# Altium schematic sheet 03_peripheral.SchDoc
size A3; SheetNumber: 4; SheetTotal: 4
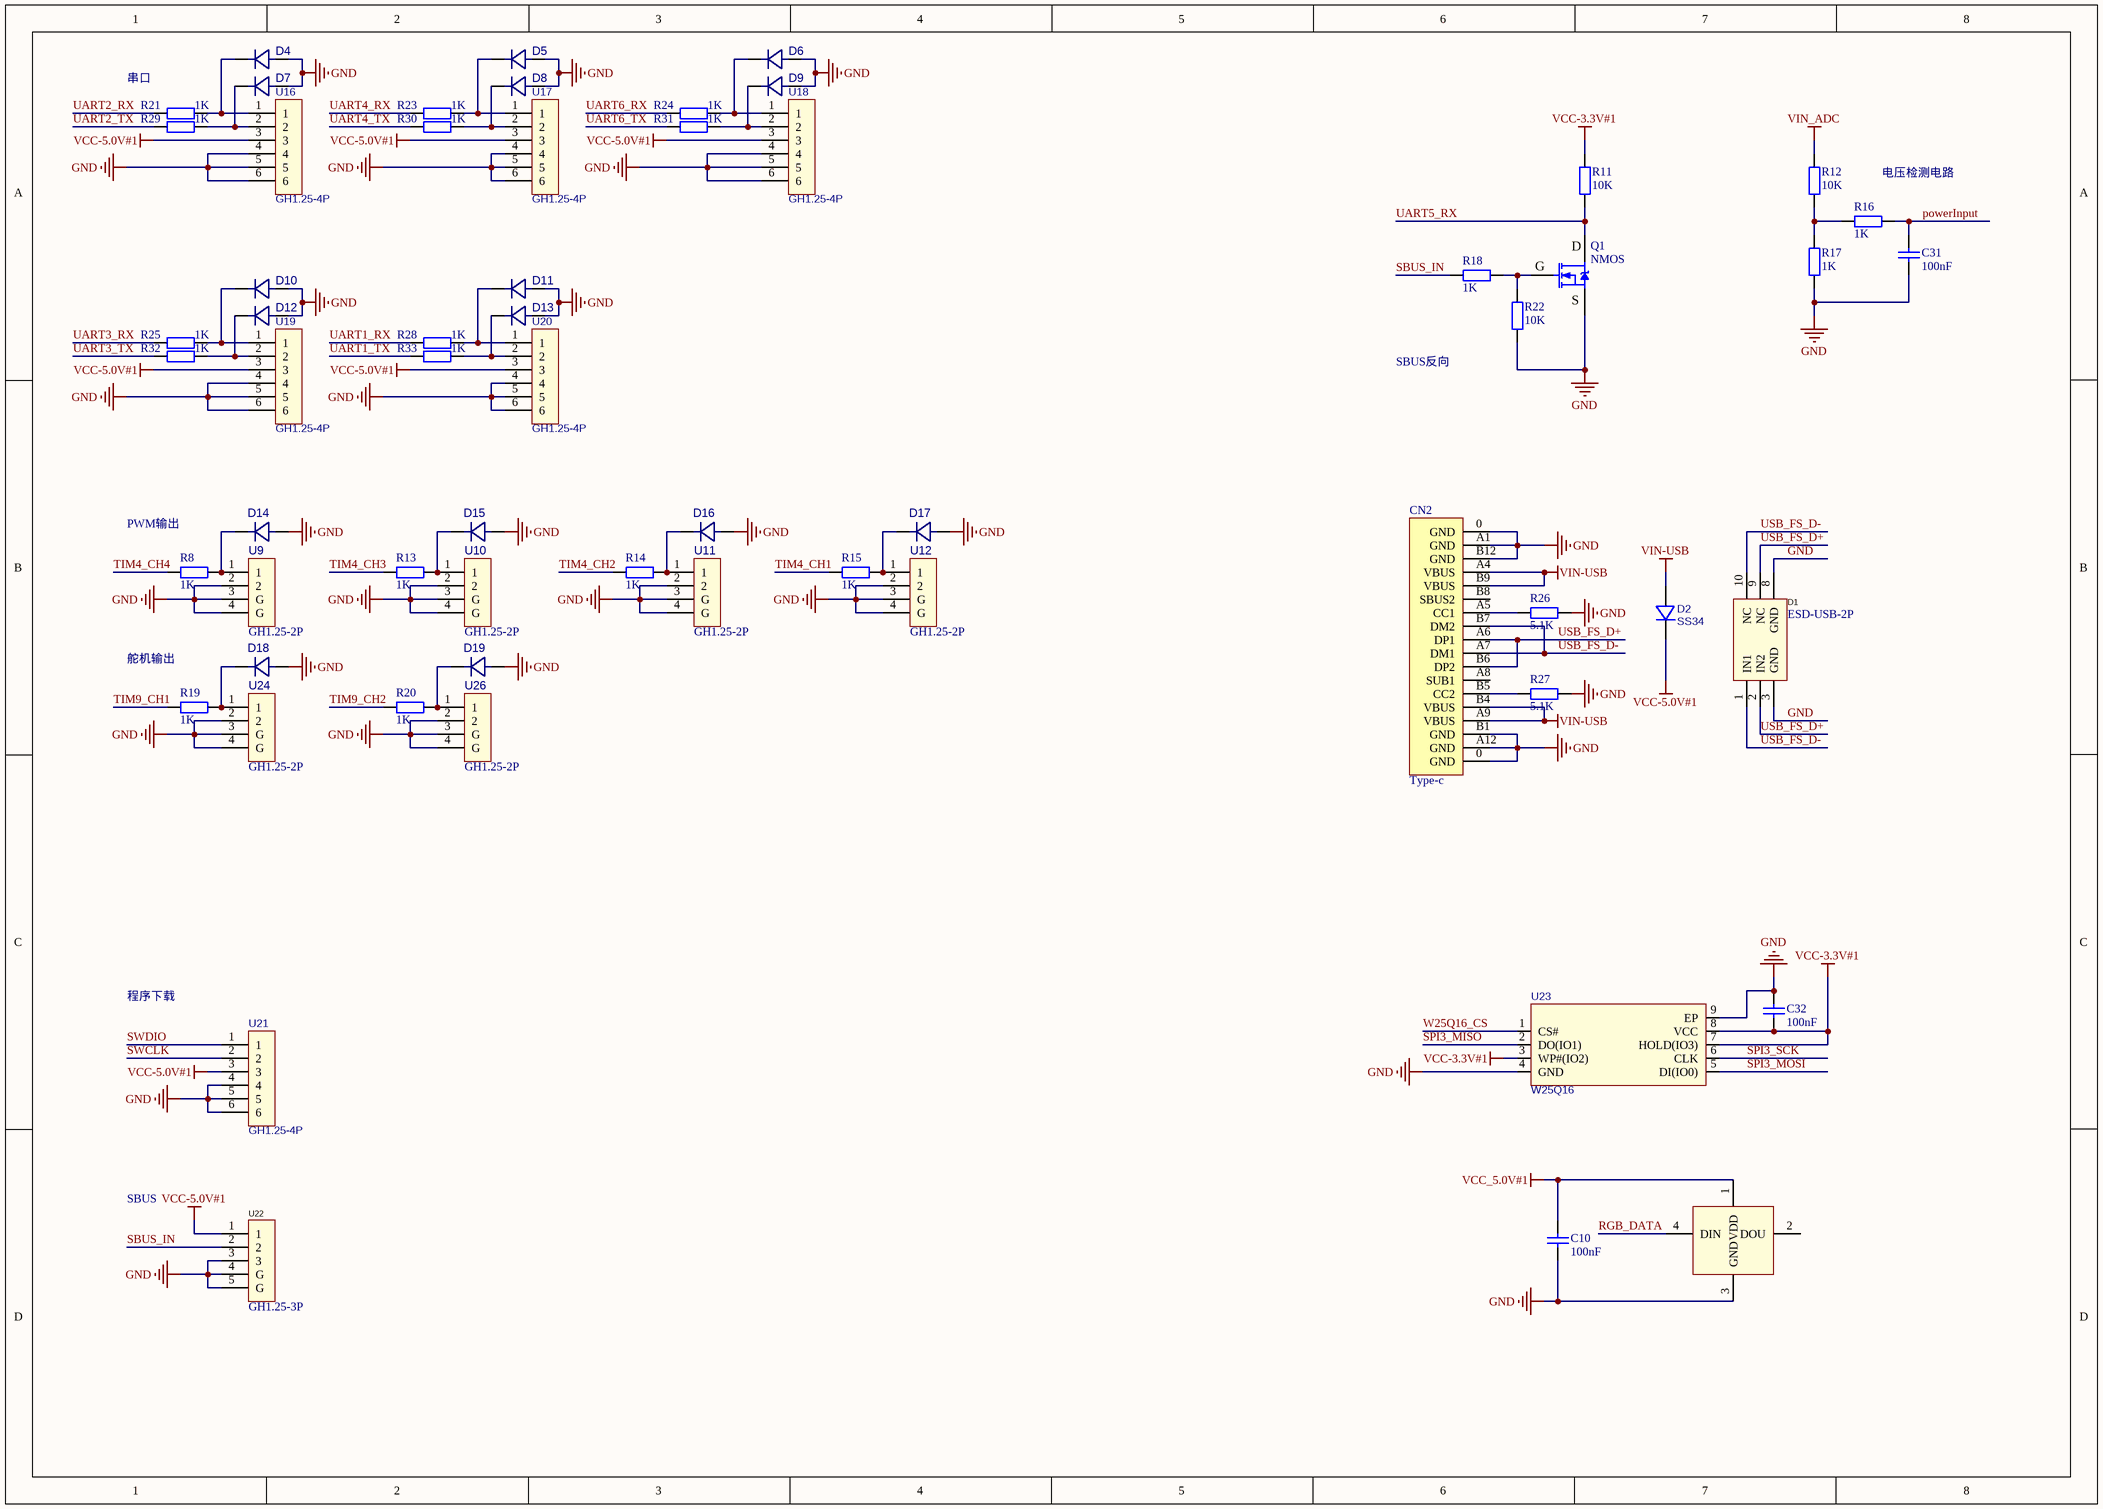
[diagram p0: 03_peripheral.SchDoc]

## Parts
C10  100nF  [0603-C]
C31  100nF  [0603-C]
C32  100nF  [0603-C]
CN2  Type-c  [Type-c 16pin]
D1  ESD-USB-2P  [SLP2510P8-2P]
D2  SS34  [SS34-SMA]
D4  ESD9X5.0ST5G  [ESD9X5.0ST5G]  (value not drawn)
D5  ESD9X5.0ST5G  [ESD9X5.0ST5G]  (value not drawn)
D6  ESD9X5.0ST5G  [ESD9X5.0ST5G]  (value not drawn)
D7  ESD9X5.0ST5G  [ESD9X5.0ST5G]  (value not drawn)
D8  ESD9X5.0ST5G  [ESD9X5.0ST5G]  (value not drawn)
D9  ESD9X5.0ST5G  [ESD9X5.0ST5G]  (value not drawn)
D10  ESD9X5.0ST5G  [ESD9X5.0ST5G]  (value not drawn)
D11  ESD9X5.0ST5G  [ESD9X5.0ST5G]  (value not drawn)
D12  ESD9X5.0ST5G  [ESD9X5.0ST5G]  (value not drawn)
D13  ESD9X5.0ST5G  [ESD9X5.0ST5G]  (value not drawn)
D14  ESD9X5.0ST5G  [ESD9X5.0ST5G]  (value not drawn)
D15  ESD9X5.0ST5G  [ESD9X5.0ST5G]  (value not drawn)
D16  ESD9X5.0ST5G  [ESD9X5.0ST5G]  (value not drawn)
D17  ESD9X5.0ST5G  [ESD9X5.0ST5G]  (value not drawn)
D18  ESD9X5.0ST5G  [ESD9X5.0ST5G]  (value not drawn)
D19  ESD9X5.0ST5G  [ESD9X5.0ST5G]  (value not drawn)
LED3  WS2812B-5050  [WS2812B-5050]  (value not drawn)
Q1  NMOS  [SOT23-3M]
R8  1K  [0603-R]
R11  10K  [0603-R]
R12  10K  [0603-R]
R13  1K  [0603-R]
R14  1K  [0603-R]
R15  1K  [0603-R]
R16  1K  [0603-R]
R17  1K  [0603-R]
R18  1K  [0603-R]
R19  1K  [0603-R]
R20  1K  [0603-R]
R21  1K  [0603-R]
R22  10K  [0603-R]
R23  1K  [0603-R]
R24  1K  [0603-R]
R25  1K  [0603-R]
R26  5.1K  [0603-R]
R27  5.1K  [0603-R]
R28  1K  [0603-R]
R29  1K  [0603-R]
R30  1K  [0603-R]
R31  1K  [0603-R]
R32  1K  [0603-R]
R33  1K  [0603-R]
U9  GH1.25-2P  [GH1.25-2P]
U10  GH1.25-2P  [GH1.25-2P]
U11  GH1.25-2P  [GH1.25-2P]
U12  GH1.25-2P  [GH1.25-2P]
U16  GH1.25-4P  [CONN-SMD_GH1.25-4PWBPZ]
U17  GH1.25-4P  [CONN-SMD_GH1.25-4PWBPZ]
U18  GH1.25-4P  [CONN-SMD_GH1.25-4PWBPZ]
U19  GH1.25-4P  [CONN-SMD_GH1.25-4PWBPZ]
U20  GH1.25-4P  [CONN-SMD_GH1.25-4PWBPZ]
U21  GH1.25-4P  [CONN-SMD_GH1.25-4PWBPZ]
U22  GH1.25-3P  [GH1.25-3P]
U23  W25Q16  [W25QXX_WSON_8_5*6mm]
U24  GH1.25-2P  [GH1.25-2P]
U26  GH1.25-2P  [GH1.25-2P]

## Nets
GND: C10.1 C31.1 C32.2 CN2.0(GND) CN2.A1(GND) CN2.A12(GND) CN2.B1(GND) CN2.B12(GND) D1.3(GND) D1.8(GND) D4.2(A) D5.2(A) D6.2(A) D7.2(A) D8.2(A) D9.2(A) D10.2(A) D11.2(A) D12.2(A) D13.2(A) D14.2(A) D15.2(A) D16.2(A) D17.2(A) D18.2(A) D19.2(A) LED3.3(GND) Q1.2(S) R17.1 R22.1 R26.2 R27.2 U9.2 U9.3(G) U9.4(G) U10.2 U10.3(G) U10.4(G) U11.2 U11.3(G) U11.4(G) U12.2 U12.3(G) U12.4(G) U16.4 U16.5 U16.6 U17.4 U17.5 U17.6 U18.4 U18.5 U18.6 U19.4 U19.5 U19.6 U20.4 U20.5 U20.6 U21.4 U21.5 U21.6 U22.3 U22.4(G) U22.5(G) U23.4(GND) U23.9(EP) U24.2 U24.3(G) U24.4(G) U26.2 U26.3(G) U26.4(G)
VCC-3.3V#1: C32.1 R11.2 U23.3(WP#(IO2)) U23.7(HOLD(IO3)) U23.8(VCC)
VCC-5.0V#1: D2.2(-) U16.3 U17.3 U18.3 U19.3 U20.3 U21.3 U22.1
VCC_5.0V#1: C10.2 LED3.1(VDD)
VIN-USB: CN2.A4(VBUS) CN2.A9(VBUS) CN2.B4(VBUS) CN2.B9(VBUS) D2.1(+)
VIN_ADC: R12.2
powerInput: C31.2 R16.2
RGB_DATA: LED3.4(DIN)
SBUS_IN: R18.1 U22.2
SPI3_MISO: U23.2(DO(IO1))
SPI3_MOSI: U23.5(DI(IO0))
SPI3_SCK: U23.6(CLK)
SWCLK: U21.2
SWDIO: U21.1
TIM4_CH1: R15.1
TIM4_CH2: R14.1
TIM4_CH3: R13.1
TIM4_CH4: R8.1
TIM9_CH1: R19.1
TIM9_CH2: R20.1
UART1_RX: R28.1
UART1_TX: R33.1
UART2_RX: R21.1
UART2_TX: R29.1
UART3_RX: R25.1
UART3_TX: R32.1
UART4_RX: R23.1
UART4_TX: R30.1
UART5_RX: Q1.3(D) R11.1
UART6_RX: R24.1
UART6_TX: R31.1
USB_FS_D+: CN2.A6(DP1) CN2.B6(DP2) D1.2(IN2) D1.9(NC)
USB_FS_D-: CN2.A7(DM1) CN2.B7(DM2) D1.1(IN1) D1.10(NC)
W25Q16_CS: U23.1(CS#)
NetCN2_A5: CN2.A5(CC1) R26.1
NetCN2_B5: CN2.B5(CC2) R27.1
NetD4_1: D4.1(K) R21.2 U16.1
NetD5_1: D5.1(K) R23.2 U17.1
NetD6_1: D6.1(K) R24.2 U18.1
NetD7_1: D7.1(K) R29.2 U16.2
NetD8_1: D8.1(K) R30.2 U17.2
NetD9_1: D9.1(K) R31.2 U18.2
NetD10_1: D10.1(K) R25.2 U19.1
NetD11_1: D11.1(K) R28.2 U20.1
NetD12_1: D12.1(K) R32.2 U19.2
NetD13_1: D13.1(K) R33.2 U20.2
NetD14_1: D14.1(K) R8.2 U9.1
NetD15_1: D15.1(K) R13.2 U10.1
NetD16_1: D16.1(K) R14.2 U11.1
NetD17_1: D17.1(K) R15.2 U12.1
NetD18_1: D18.1(K) R19.2 U24.1
NetD19_1: D19.1(K) R20.2 U26.1
NetQ1_1: Q1.1(G) R18.2 R22.2
NetR12_1: R12.1 R16.1 R17.2

Not connected (* = marked no-connect by the designer): CN2 A8(SUB1) B8(SBUS2); LED3 2(DOU)

## Notes on the sheet
- 串口
- (near R16) 电压检测电路
- SBUS反向
- (near R8) PWM输出
- (near R19) 舵机输出
- 程序下载
- SBUS

## Library data of the parts
C10 C31 C32 = C: 贴片电容; BOM名称: 无极性贴片电容; 联系卖家，免费查找封装: 唯一出售店铺网址https://shop463601444.taobao.com
CN2 = Type-c: U262-161N-4BVC11
D1 = ESD-USB-2P: RClamp0522PATCT; Manufacturer: SEMTECH; Name: RClamp0524PATCT; Device: RClamp0524PATCT_C40960; Add into BOM: yes; Reverse Stand-Off Voltage (Vrwm): 5V; Breakdown Voltage (VBR): 6V; Clamping Voltage@Ipp: 15V; Peak Pulse Power(Ppp)@8/20us: 150W; Junction Capacitance(Cj)@1MHz: 0.8pF@1MHz; Symbol: RClamp0524PATCT; LCSC Part Name: RClamp0524PATCT; Supplier Part: C40960; Manufacturer Part: RClamp0524PATCT; Supplier Footprint: SLP2510P8; JLCPCB Part Class: Extended Part; Datasheet: https://atta.szlcsc.com/upload/public/pdf/source/20150124/1457707260739.pdf; Supplier: LCSC; Convert to PCB: yes; Operating Temperature: -55℃~+125℃@(Tj)
D2 = SS34: BOM_Manufacturer: Wuxi ARK Tech Elec; BOM_Manufacturer Part: D-G060306G1-KS2; Contributor: LCSC; BOM_Supplier: LCSC; BOM_Supplier Part: C118334; BOM_JLCPCB Part Class: Extended Part; spicePre: L; spiceSymbolName: D-G060306G1-KS2
D4-D19 = ESD9X5.0ST5G: Manufacturer: MSKSEMI(美森科); Symbol: ESD9X5.0ST5G_C3008066; Add into BOM: yes; Name: ESD9X5.0ST5G; Device: ESD9X5.0ST5G_C3008066; LCSC Part Name: ESD9X5.0ST5G; Supplier Part: C3008066; Manufacturer Part: ESD9X5.0ST5G; Supplier Footprint: SOD-923; JLCPCB Part Class: Extended Part; Datasheet: https://atta.szlcsc.com/upload/public/pdf/source/20220429/68E9B40153609821FAF30C4C48AA4713.pdf; Supplier: LCSC; Convert to PCB: yes
LED3 = WS2812B-5050: Manufacturer: XINGLIGHT(成兴光); Name: XL-5050RGBC-WS2812B; Add into BOM: yes; Emitted Color: RGB三色; Lens Color: 无色透明; Peak Wavelength: 625nm；470nm；530nm; Viewing Angle: 120°; Mounting Sytle: 正贴; Symbol: XL-5050RGBC-WS2812B; Device: XL-5050RGBC-WS2812B; LCSC Part Name: RGB三色 正贴 幻彩; Supplier Part: C2843785; Manufacturer Part: XL-5050RGBC-WS2812B; Supplier Footprint: SMD5050; JLCPCB Part Class: Extended Part; Datasheet: https://atta.szlcsc.com/upload/public/pdf/source/20230111/86AAD2096485A2E5BCAB883FF8CBE6FD.pdf; Supplier: LCSC; Convert to PCB: yes; Diode Configuration: -; Dominant Wavelength: -; Color Temperature: -; Forward Current: -; Power Dissipation: -; Operating Temperature: -30℃~+70℃
Q1 = AO3400: N沟道 30V/4.2A; BOM名称: 场效应管; 联系卖家，免费查找封装: 唯一出售店铺网址https://shop463601444.taobao.com; 参数: N沟道 30V/4.2A
R8 R11-R33 = R: 贴片电阻; 联系卖家，免费查找封装: 唯一出售店铺网址https://shop463601444.taobao.com; BOM名称: 贴片电阻
U9-U12 U24 U26 = GH1.25-2P: Manufacturer: Bossie(博锡); Symbol: BX-GH1.25-2PWT; Add into BOM: yes; Pins Structure: 1x2P; Pitch: 1.25mm; Reference Series: GH; Number of PINs Per Row: 2; Current Rating (Max): 1A; Device: BX-GH1.25-2PWT; Supplier: LCSC; Supplier Part: C18077718; Manufacturer Part: BX-GH1.25-2PWT; LCSC Part Name: BX-GH1.25-2PWT; Supplier Footprint: SMD,P=1.25mm,卧贴; Datasheet: https://atta.szlcsc.com/upload/public/pdf/source/20231017/25DD0A5C9398B9B8D9D2789B9E1BDAD3.pdf; Convert to PCB: yes; Mounting Style: 卧贴; Number of Pins: 2P; Number of Rows: 1; Row Spacing: -; Contact Material: 磷铜; Contact Plating: 锡; Operating Temperature Range: -25℃~+85℃
U16-U21 = GH1.25-4P: GH1.25-4PWBPZ; BOM_Manufacturer: BOOMELE(博穆精密); Contributor: LCSC; BOM_Supplier: LCSC; BOM_Supplier Part: C2829253; BOM_Manufacturer Part: GH1.25-4PWBPZ; spicePre: U; spiceSymbolName: GH1.25-4PWBPZ
U22 = GH1.25-3P: Manufacturer: Bossie(博锡); Symbol: BX-GH1.25-3PWT; Add into BOM: yes; Pins Structure: 1x3P; Pitch: 1.25mm; Reference Series: GH; Number of PINs Per Row: 3; Current Rating (Max): 1A; Device: BX-GH1.25-3PWT; Supplier: LCSC; Supplier Part: C18077719; Manufacturer Part: BX-GH1.25-3PWT; LCSC Part Name: BX-GH1.25-3PWT; Supplier Footprint: SMD,P=1.25mm,卧贴; Datasheet: https://atta.szlcsc.com/upload/public/pdf/source/20231017/A589687BD41735CD2F726065058FB819.pdf; Convert to PCB: yes; Mounting Style: 卧贴; Number of Pins: 3P; Number of Rows: 1; Row Spacing: -; Contact Material: 磷铜; Contact Plating: 锡; Operating Temperature Range: -25℃~+85℃
U23 = W25Q256: BOM_Manufacturer: WINBOND(华邦); BOM_Manufacturer Part: W25Q256JVEIQ; Contributor: LCSC; BOM_Supplier: LCSC; BOM_Supplier Part: C2682312; BOM_JLCPCB Part Class: Extended Part; spicePre: U; spiceSymbolName: W25Q256JVEIQ